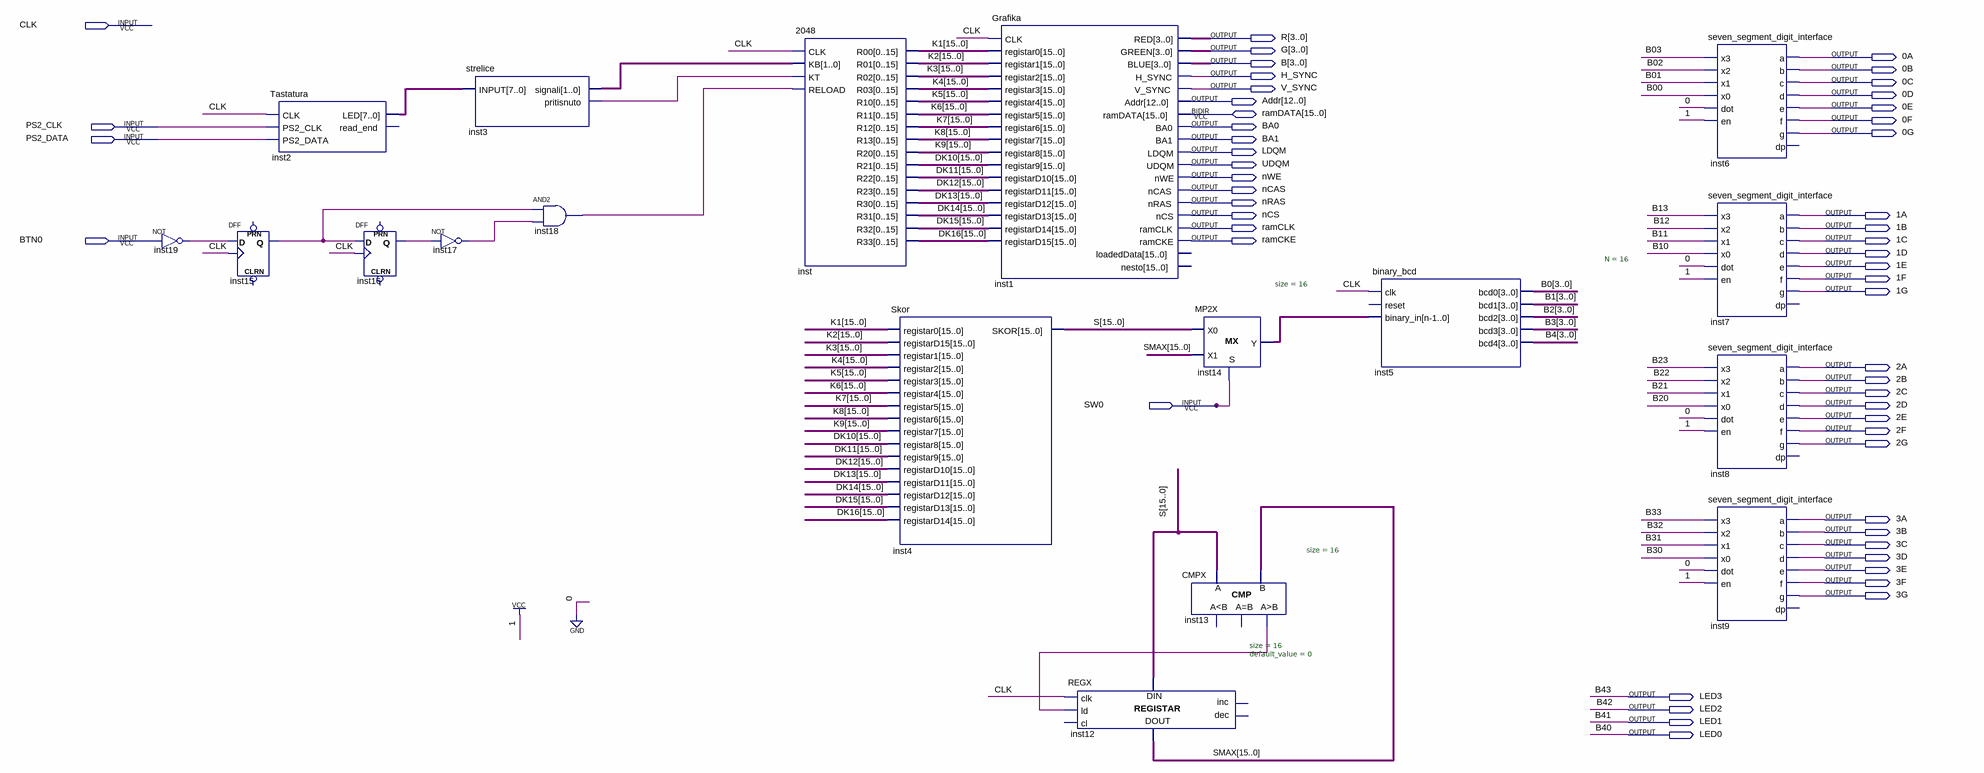
[diagram p0: schematic sheet]
// Quartus schematic main.bdf as structural Verilog: 18 symbols, 54 pins
module main (
  input  CLK,
  input  PS2_CLK,
  input  PS2_DATA,
  input  BTN0,
  input  SW0,
  inout  [15:0] ramDATA,
  output [3:0] R,
  output [3:0] G,
  output \0A ,
  output [3:0] B,
  output \0B ,
  output H_SYNC,
  output \0C ,
  output V_SYNC,
  output \0D ,
  output [12:0] Addr,
  output \0E ,
  output \0F ,
  output BA0,
  output \0G ,
  output BA1,
  output LDQM,
  output UDQM,
  output nWE,
  output nCAS,
  output nRAS,
  output nCS,
  output \1A ,
  output ramCLK,
  output \1B ,
  output ramCKE,
  output \1C ,
  output \1D ,
  output \1E ,
  output \1F ,
  output \1G ,
  output \2A ,
  output \2B ,
  output \2C ,
  output \2D ,
  output \2E ,
  output \2F ,
  output \2G ,
  output \3A ,
  output \3B ,
  output \3C ,
  output \3D ,
  output \3E ,
  output \3F ,
  output \3G ,
  output LED3,
  output LED2,
  output LED1,
  output LED0
);

  wire inst3_pritisnuto, inst13_gr, inst15_q, inst16_q, inst17_out, inst18_out, inst19_out;
  wire [1:0] inst3_signali;
  wire [3:0] B0, B1, B2, B3;
  wire [7:0] inst2_led;
  wire [15:0] DK10, DK11, DK12, DK13, DK14, DK15, DK16, inst14_y, K1, K2, K3, K4, K5, K6, K7, K8, K9, S, SMAX;

  not inst19 (inst19_out, BTN0);
  DFF inst15 (.CLK(CLK), .D(inst19_out), .Q(inst15_q));  // open: CLRN, PRN
  Tastatura inst2 (.CLK(CLK), .PS2_CLK(PS2_CLK), .PS2_DATA(PS2_DATA), .LED(inst2_led));  // open: read_end
  DFF inst16 (.CLK(CLK), .D(inst15_q), .Q(inst16_q));  // open: CLRN, PRN
  not inst17 (inst17_out, inst16_q);
  strelice inst3 (.INPUT(inst2_led), .signali(inst3_signali), .pritisnuto(inst3_pritisnuto));
  and inst18 (inst18_out, inst15_q, inst17_out);
  \2048  inst (
    .CLK(CLK), .KB(inst3_signali), .KT(inst3_pritisnuto), .RELOAD(inst18_out), .R00(K1), .R01(K2), .R02(K3),
    .R03(K4), .R10(K5), .R11(K6), .R12(K7), .R13(K8), .R20(K9), .R21(DK10), .R22(DK11), .R23(DK12),
    .R30(DK13), .R31(DK14), .R32(DK15), .R33(DK16));
  Skor inst4 (
    .registar0(K1), .registarD15(K2), .registar1(K3), .registar2(K4), .registar3(K5), .registar4(K6),
    .registar5(K7), .registar6(K8), .registar7(K9), .registar8(DK10), .registar9(DK11), .registarD10(DK12),
    .registarD11(DK13), .registarD12(DK14), .registarD13(DK15), .registarD14(DK16), .SKOR(S));
  Grafika inst1 (
    .CLK(CLK), .registar0(K1), .registar1(K2), .registar2(K3), .registar3(K4), .registar4(K5),
    .registar5(K6), .registar6(K7), .registar7(K8), .registar8(K9), .registar9(DK10), .registarD10(DK11),
    .registarD11(DK12), .registarD12(DK13), .registarD13(DK14), .registarD14(DK15), .registarD15(DK16),
    .RED(R), .GREEN(G), .BLUE(B), .H_SYNC(H_SYNC), .V_SYNC(V_SYNC), .Addr(Addr), .BA0(BA0), .BA1(BA1),
    .LDQM(LDQM), .UDQM(UDQM), .nWE(nWE), .nCAS(nCAS), .nRAS(nRAS), .nCS(nCS), .ramCLK(ramCLK),
    .ramCKE(ramCKE), .ramDATA(ramDATA));  // open: loadedData, nesto
  REGX #(.size(16), .default_value(0)) inst12 (
    .clk(CLK), .ld(inst13_gr), .data_in(S), .data_out(SMAX));  // open: cl, inc, dec
  MP2X #(.size(16)) inst14 (.S(SW0), .X0(S), .X1(SMAX), .Y(inst14_y));
  CMPX #(.size(16)) inst13 (.A(S), .B(SMAX), .gr(inst13_gr));  // open: ls, eq
  binary_bcd #(.N(16)) inst5 (
    .clk(CLK), .binary_in(inst14_y), .bcd0(B0), .bcd1(B1), .bcd2(B2), .bcd3(B3),
    .bcd4({LED3, LED2, LED1, LED0}));  // open: reset
  seven_segment_digit_interface inst6 (
    .x3(B0[3]), .x2(B0[2]), .x1(B0[1]), .x0(B0[0]), .dot(1'b0), .en(1'b1), .a(\0A ), .b(\0B ), .c(\0C ),
    .d(\0D ), .e(\0E ), .f(\0F ), .g(\0G ));  // open: dp
  seven_segment_digit_interface inst7 (
    .x3(B1[3]), .x2(B1[2]), .x1(B1[1]), .x0(B1[0]), .dot(1'b0), .en(1'b1), .a(\1A ), .b(\1B ), .c(\1C ),
    .d(\1D ), .e(\1E ), .f(\1F ), .g(\1G ));  // open: dp
  seven_segment_digit_interface inst8 (
    .x3(B2[3]), .x2(B2[2]), .x1(B2[1]), .x0(B2[0]), .dot(1'b0), .en(1'b1), .a(\2A ), .b(\2B ), .c(\2C ),
    .d(\2D ), .e(\2E ), .f(\2F ), .g(\2G ));  // open: dp
  seven_segment_digit_interface inst9 (
    .x3(B3[3]), .x2(B3[2]), .x1(B3[1]), .x0(B3[0]), .dot(1'b0), .en(1'b1), .a(\3A ), .b(\3B ), .c(\3C ),
    .d(\3D ), .e(\3E ), .f(\3F ), .g(\3G ));  // open: dp

  // Other names for the same wires on the sheet: B4[3:0] = {LED3, LED2, LED1, LED0}; B40 = LED0; B41 = LED1;
  //   B42 = LED2; B43 = LED3
endmodule
